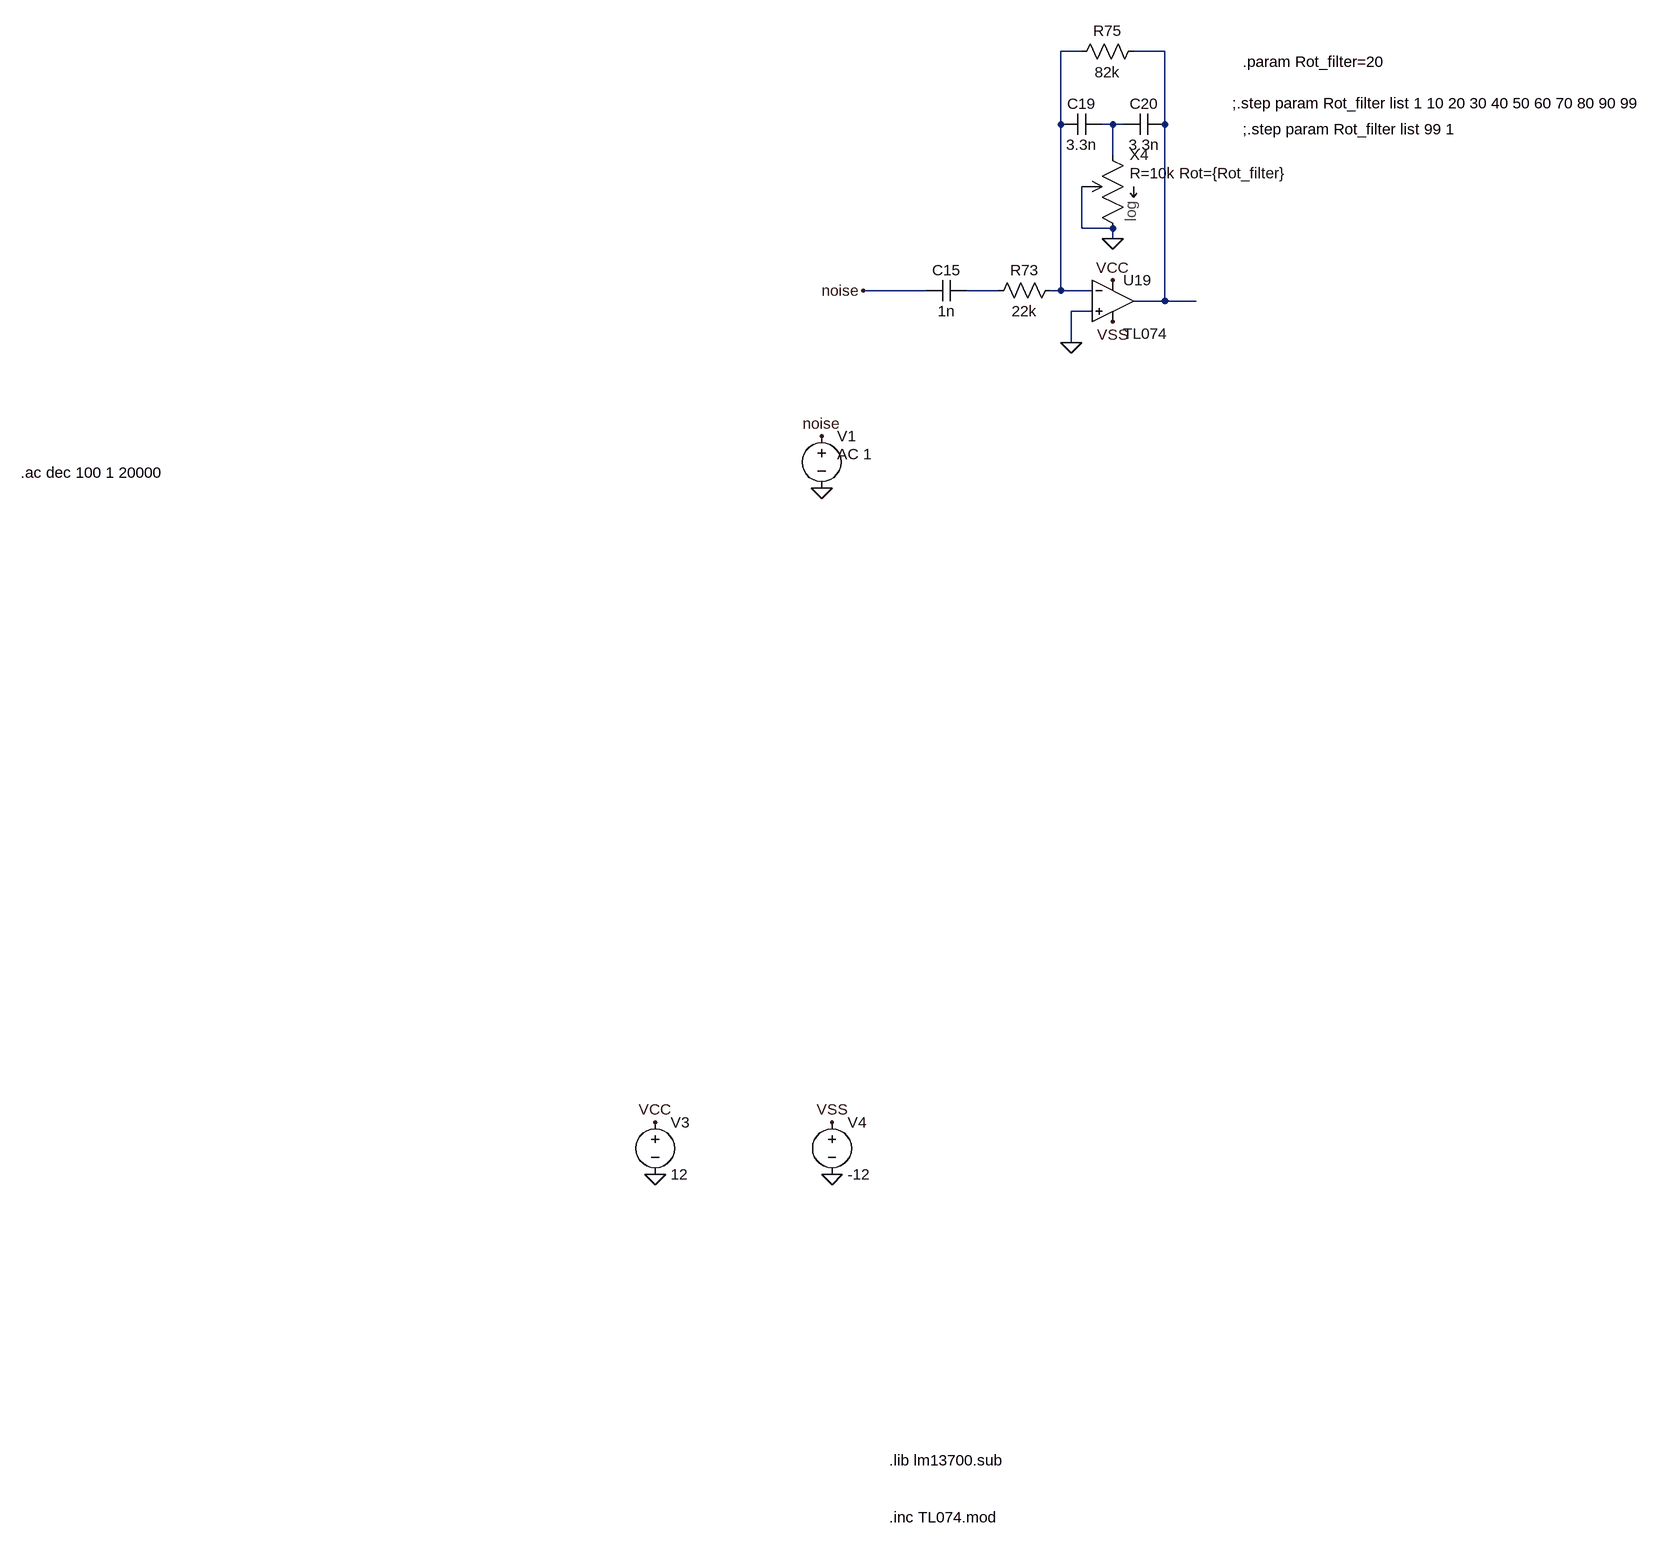
[diagram p0: schematic 808_hihat_bandpass_checkfreqresponse.asc]
808_hihat_bandpass_checkfreqresponse.asc, the LTspice schematic file:
Version 4
SHEET 1 5828 3348
WIRE -912 -2160 -944 -2160
WIRE -784 -2160 -832 -2160
WIRE -944 -2048 -944 -2160
WIRE -864 -2048 -880 -2048
WIRE -848 -2048 -864 -2048
WIRE -784 -2048 -784 -2160
WIRE -864 -2000 -864 -2048
WIRE -912 -1888 -912 -1952
WIRE -864 -1888 -912 -1888
WIRE -864 -1872 -864 -1888
WIRE -1152 -1792 -1248 -1792
WIRE -1040 -1792 -1088 -1792
WIRE -944 -1792 -944 -2048
WIRE -944 -1792 -960 -1792
WIRE -896 -1792 -944 -1792
WIRE -784 -1776 -784 -2048
WIRE -784 -1776 -832 -1776
WIRE -736 -1776 -784 -1776
WIRE -896 -1760 -928 -1760
WIRE -928 -1712 -928 -1760
FLAG -1296 -432 0
FLAG -1568 -432 0
FLAG -1568 -512 VCC
FLAG -1296 -512 VSS
FLAG -864 -1872 0
FLAG -864 -1744 VSS
FLAG -864 -1808 VCC
FLAG -928 -1712 0
FLAG -1248 -1792 noise
FLAG -1312 -1488 0
FLAG -1312 -1568 noise
SYMBOL voltage -1568 -528 R0
WINDOW 123 0 0 Left 0
WINDOW 39 0 0 Left 0
SYMATTR InstName V3
SYMATTR Value 12
SYMBOL voltage -1296 -528 R0
WINDOW 123 0 0 Left 0
WINDOW 39 0 0 Left 0
SYMATTR InstName V4
SYMATTR Value -12
SYMBOL cap -1088 -1808 R90
WINDOW 0 0 32 VBottom 2
WINDOW 3 32 32 VTop 2
SYMATTR InstName C15
SYMATTR Value 1n
SYMBOL res -944 -1808 R90
WINDOW 0 0 56 VBottom 2
WINDOW 3 32 56 VTop 2
SYMATTR InstName R73
SYMATTR Value 22k
SYMBOL Opamps\\opamp2 -864 -1840 R0
WINDOW 3 16 114 Left 2
SYMATTR Value TL074
SYMATTR InstName U19
SYMBOL res -816 -2176 R90
WINDOW 0 0 56 VBottom 2
WINDOW 3 32 56 VTop 2
SYMATTR InstName R75
SYMATTR Value 82k
SYMBOL cap -880 -2064 R90
WINDOW 0 0 32 VBottom 2
WINDOW 3 32 32 VTop 2
SYMATTR InstName C19
SYMATTR Value 3.3n
SYMBOL cap -784 -2064 R90
WINDOW 0 0 32 VBottom 2
WINDOW 3 32 32 VTop 2
SYMATTR InstName C20
SYMATTR Value 3.3n
SYMBOL pot_log -880 -1984 R0
WINDOW 39 42 11 Left 2
SYMATTR SpiceLine R=10k Rot={Rot_filter}
SYMATTR InstName X4
SYMBOL voltage -1312 -1584 R0
WINDOW 123 0 0 Left 0
WINDOW 39 0 0 Left 0
WINDOW 3 24 44 Left 2
SYMATTR Value AC 1
SYMATTR InstName V1
TEXT -1208 96 Left 2 !.inc TL074.mod
TEXT -1208 8 Left 2 !.lib lm13700.sub
TEXT -680 -2080 Left 2 !;.step param Rot_filter list 1 10 20 30 40 50 60 70 80 90 99
TEXT -664 -2144 Left 2 !.param Rot_filter=20
TEXT -2544 -1512 Left 2 !.ac dec 100 1 20000
TEXT -664 -2040 Left 2 !;.step param Rot_filter list 99 1

The netlist it stands for:
* 808_hihat_bandpass_checkfreqresponse.asc
V3 VCC 0 12
V4 VSS 0 -12
C15 N004 noise 1n
R73 N001 N004 22k
XU19 0 N001 VCC VSS N002 TL074  ; pins In+ In- V+ V- OUT
R75 N002 N001 82k
C19 N003 N001 3.3n
C20 N002 N003 3.3n
XX4 N003 0 0 pot_log R=10k Rot={Rot_filter}  ; pins 1 2 3
V1 noise 0 AC 1
.inc TL074.mod
.lib lm13700.sub
;.step param Rot_filter list 1 10 20 30 40 50 60 70 80 90 99
.param Rot_filter=20
.ac dec 100 1 20000
;.step param Rot_filter list 99 1
.backanno
.end